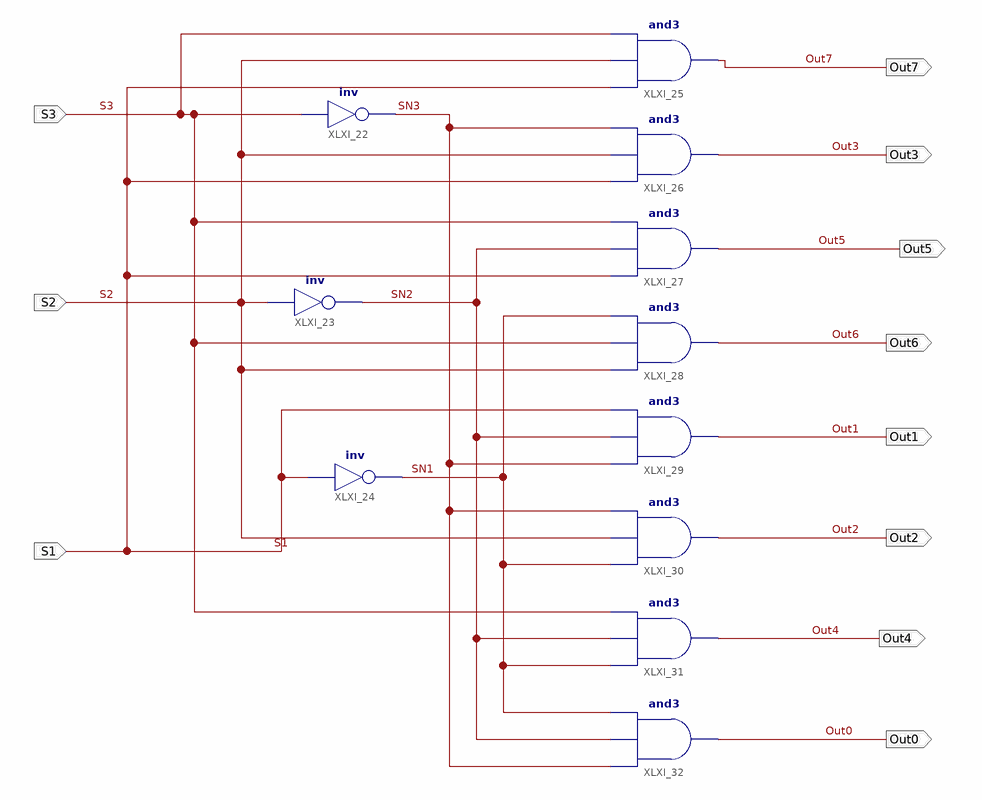
[diagram p0: schematic sheet 1]
// Xilinx ISE schematic encode8.sch (spartan2e) as structural Verilog: 11 symbols, 11 ports
module encode8 (
  input  S1,
  input  S2,
  input  S3,
  output Out7,
  output Out3,
  output Out5,
  output Out6,
  output Out1,
  output Out2,
  output Out4,
  output Out0
);

  wire SN1, SN2, SN3;

  and XLXI_25 (Out7, S1, S2, S3);
  and XLXI_26 (Out3, S1, S2, SN3);
  and XLXI_27 (Out5, S1, SN2, S3);
  and XLXI_28 (Out6, S2, S3, SN1);
  and XLXI_29 (Out1, SN3, SN2, S1);
  and XLXI_30 (Out2, SN1, S2, SN3);
  and XLXI_31 (Out4, SN1, SN2, S3);
  and XLXI_32 (Out0, SN3, SN2, SN1);
  not XLXI_23 (SN2, S2);
  not XLXI_22 (SN3, S3);
  not XLXI_24 (SN1, S1);
endmodule
